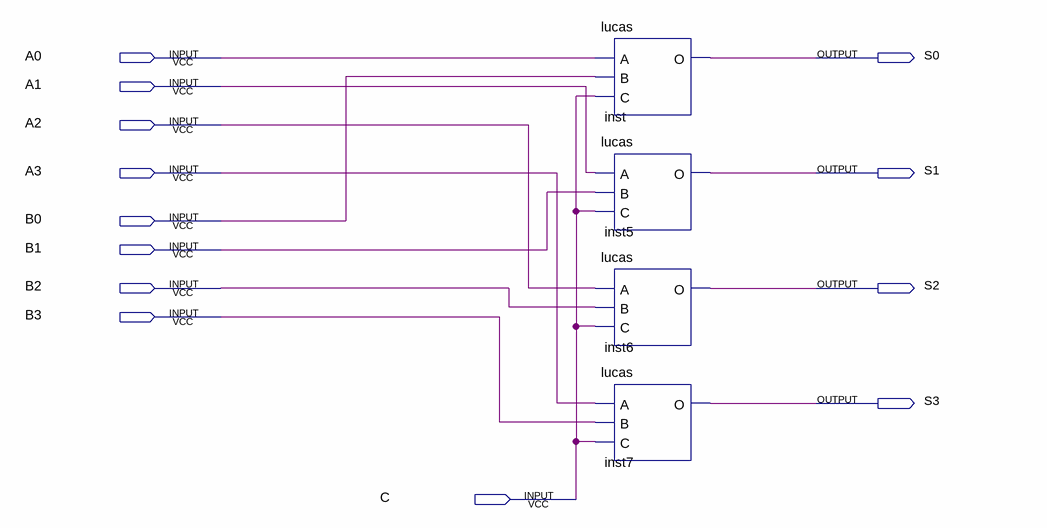
[diagram p0: schematic sheet]
// Quartus schematic murilo.bdf as structural Verilog: 4 symbols, 13 pins
module murilo (
  input  A0,
  input  A1,
  input  A2,
  input  A3,
  input  B0,
  input  B1,
  input  B2,
  input  B3,
  input  C,
  output S0,
  output S1,
  output S2,
  output S3
);

  lucas inst (.A(A0), .B(B0), .C(C), .O(S0));
  lucas inst5 (.A(A1), .B(B1), .C(C), .O(S1));
  lucas inst6 (.A(A2), .B(B2), .C(C), .O(S2));
  lucas inst7 (.A(A3), .B(B3), .C(C), .O(S3));
endmodule
